# Altium schematic sheet Connectors.SchDoc: Connectors
size A4; Date: Not used; ApprovedBy: Not used; CheckedBy: Not used; Author: Not used; CompanyName: STMicroelectronics; DrawnBy: Not used; Engineer: Not used; Organization: Not used; Address1: Not used; Address2: Not used; Address3: Not used; Address4: Not used; DocumentNumber: 6; Revision: Not used; SheetNumber: 6; SheetTotal: 8; CurrentTime: Not used; CurrentDate: Not used; Time: Not used; DocumentFullPathAndName: Not used; DocumentName: Not used; ModifiedDate: Not used; ImagePath: Not used; ProjectName: Not used; Application_BuildNumber: Not used
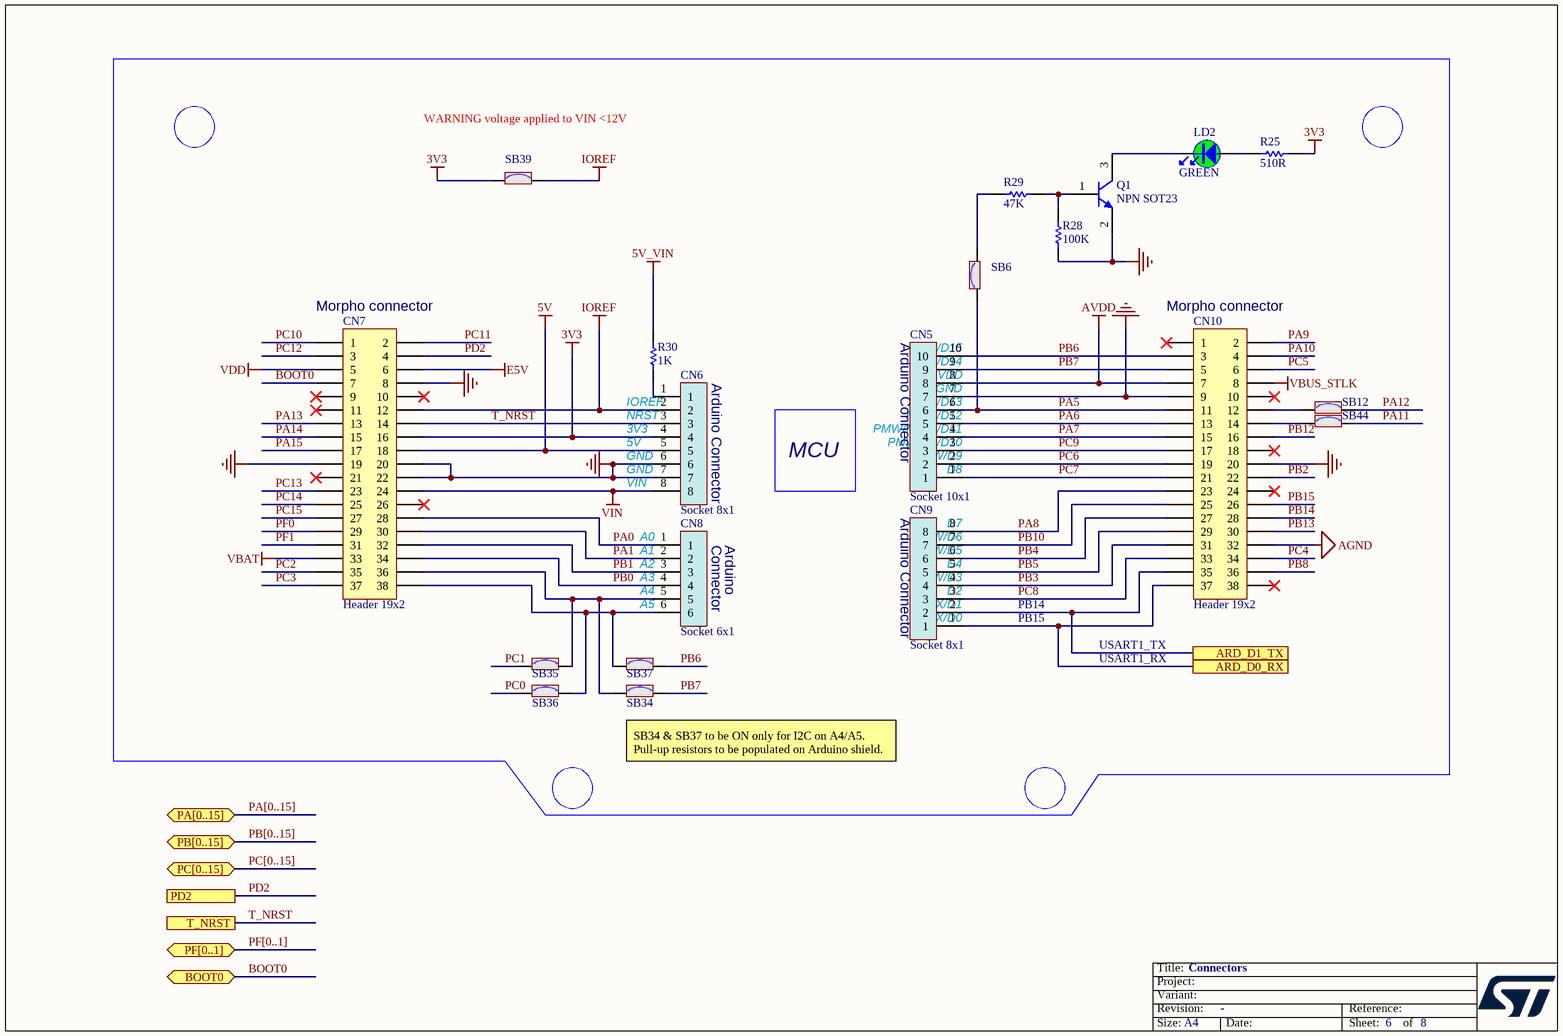
[diagram p0: Connectors.SchDoc]

## Parts
CN5  Socket 10x1  [CON_SAMTEC_SSQ-110-03-F-S]
CN6  Socket 8x1  [CON_SAMTEC_SSQ-108-03-F-S]
CN7  value Header 19x2  [CON_SAMTEC_TSW-119-09-X-D]
CN8  Socket 6x1  [CON_SAMTEC_SSQ-106-03-F-S]
CN9  Socket 8x1  [CON_SAMTEC_SSQ-108-03-F-S]
CN10  value Header 19x2  [CON_SAMTEC_TSW-119-09-X-D]
LD2  value GREEN  [LED_0603_OSRAM_LG-Q396-PS-35_GREEN_1A2K_H0P4]  (hidden comment: LED_green)
Q1  value NPN SOT23  [NPN_SOT23]
R25  value 510R  [R0603]
R28  value 100K  [R0603]
R29  value 47K  [R0603]
R30  value 1K  [R0603]
SB6  (no value)  [SOLDER-BRIDGE_R0603-0R]
SB12  (no value)  [SOLDER-BRIDGE_R0603-0R]
SB34  (no value)  [SOLDER-BRIDGE_R0603-0R]
SB35  (no value)  [SOLDER-BRIDGE_R0603-0R]
SB36  (no value)  [SOLDER-BRIDGE_R0603-0R]
SB37  (no value)  [SOLDER-BRIDGE_R0603-0R]
SB39  (no value)  [SOLDER-BRIDGE_R0603-0R]
SB44  (no value)  [SOLDER-BRIDGE_R0603-0R]

## Ports
ARD_D0_RX, ARD_D1_TX, BOOT0 (bidir), PA[0..15] (bidir), PB[0..15] (bidir), PC[0..15] (bidir), PD2, PF[0..1] (bidir), T_NRST

## Nets
3V3: CN6.4 CN7.16 R25.1 SB39.1
5V: CN6.5 CN7.18
5V_VIN: R30.2
AGND: CN10.32
AVDD: CN5.8 CN10.7
E5V: CN7.6
GND: CN5.7 CN6.6 CN6.7 CN7.8 CN7.19 CN7.20 CN7.22 CN10.9 CN10.20 Q1.2(E) R28.1
IOREF: CN6.2 CN7.12 SB39.2
VBAT: CN7.33
VBUS_STLK: CN10.8
VDD: CN7.5
VIN: CN6.8 CN7.24
ARD_D0_RX: CN9.1 CN10.37 ; port ARD_D0_RX
ARD_D1_TX: CN9.2 CN10.35 ; port ARD_D1_TX
BOOT0: CN7.7 ; port BOOT0
PA0: CN7.28 CN8.1
PA1: CN7.30 CN8.2
PA5: CN5.6 CN10.11 SB6.1
PA6: CN5.5 CN10.13
PA7: CN5.4 CN10.15
PA8: CN9.8 CN10.23
PA9: CN10.2
PA10: CN10.4
PA11: SB44.2
PA12: SB12.2
PA13: CN7.13
PA14: CN7.15
PA15: CN7.17
PB0: CN7.34 CN8.4
PB1: CN7.32 CN8.3
PB2: CN10.22
PB3: CN9.4 CN10.31
PB4: CN9.6 CN10.27
PB5: CN9.5 CN10.29
PB6: CN5.10 CN10.3 SB37.2
PB7: CN5.9 CN10.5 SB34.2
PB8: CN10.36
PB10: CN9.7 CN10.25
PB12: CN10.16
PB13: CN10.30
PB14: CN10.28
PB15: CN10.26
PC0: SB36.1
PC1: SB35.1
PC2: CN7.35
PC3: CN7.37
PC4: CN10.34
PC5: CN10.6
PC6: CN5.2 CN10.19
PC7: CN5.1 CN10.21
PC8: CN9.3 CN10.33
PC9: CN5.3 CN10.17
PC10: CN7.1
PC11: CN7.2
PC12: CN7.3
PC13: CN7.23
PC14: CN7.25
PC15: CN7.27
PD2: CN7.4 ; port PD2
PF0: CN7.29
PF1: CN7.31
T_NRST: CN6.3 CN7.14 ; port T_NRST
NetCN6_1: CN6.1 R30.1
NetCN7_36: CN7.36 CN8.5 SB34.1 SB35.2
NetCN7_38: CN7.38 CN8.6 SB36.2 SB37.1
NetCN10_12: CN10.12 SB12.1
NetCN10_14: CN10.14 SB44.1
NetLD2_1: LD2.1 R25.2
NetLD2_2: LD2.2 Q1.3(C)
NetQ1_1: Q1.1(B) R28.2 R29.2
NetR29_1: R29.1 SB6.2

Not connected (* = marked no-connect by the designer): CN7 9* 10* 11* 21* 26*; CN10 1* 10* 18* 24* 38*

## Buses and harness runs
bus PA[0..15] = port PA[0..15]
bus PB[0..15] = port PB[0..15]
bus PC[0..15] = port PC[0..15]
bus PF[0..1] = port PF[0..1]

## Notes on the sheet
- WARNING voltage applied to VIN <12V
- (near CN7) Morpho connector
- (near CN10) Morpho connector
- (near CN6) Arduino Connector
- (near CN5) Arduino Connector
- (near CN5) SDA/D14
- (near CN5) SCL/D15
- (near CN5) AVDD
- (near CN6) 5V
- 3V3
- NRST
- IOREF
- (near CN5) PMW/CS/D10
- (near CN5) SCK/D13
- (near CN5) MISO/D12
- (near CN5) PMW/MOSI/D11
- (near CN5) GND
- (near CN6) VIN
- (near CN6) GND
- MCU
- (near CN9) Arduino Connector
- (near CN5) D8
- (near CN5) PMW/D9
- (near CN8) A0
- (near CN8) A1
- (near CN8) A2
- (near CN8) A3
- (near CN8) Connector
- (near CN8) Arduino
- (near CN9) D4
- (near CN9) PMW/D3
- (near CN9) PMW/D5
- (near CN9) PMW/D6
- (near CN9) D7
- (near CN8) A4
- (near CN8) A5
- (near CN9) RX/D0
- (near CN9) TX/D1
- (near CN9) D2
- PB15
- PB14
- USART1_TX
- USART1_RX
- (near SB34) SB34 & SB37 to be ON only for I2C on A4/A5.
  Pull-up resistors to be populated on Arduino shield.
- Title:
- Project:
- Size:
- Revision:
- Variant:
- -
- Date:
- Reference:
- Sheet:
- of

## Library data of the parts
CN5 = MCD-02625: Socket, 10x1, 2.54mm, VR, TH, T=8.51mm/10mm; Part_Type: Connector; Part_Preference: Recommended; Manufacturer: SAMTEC; Manufacturer_Part_Number: SSQ-110-03-F-S; Order_Code_RS: 154-8308; Component_Country_Of_Origin: China, Costa Rica,  Malaysia, Vietnam, USA; ShowFields: YES; ID: 4731; Internal_Part_Number: MCD-02625; Value: Socket 10x1; Status: Checked; ComponentLink1URL: http://tunmcdsvn.tun.st.com/Component_Documentation_Library/Trunk/Connector/SAMTEC_SSQ_Series/; Order_Code_Digikey: SAM10010-ND; Order_Code_Farnell: 2667433
CN6 CN9 = MCD-02624: Socket, 8x1, 2.54mm, VR, TH, T=8.51mm/10mm; Part_Type: Connector; Part_Preference: Recommended; Manufacturer: SAMTEC; Manufacturer_Part_Number: SSQ-108-03-F-S; Order_Code_RS: 180-0395; Component_Country_Of_Origin: China, Costa Rica,  Malaysia, Vietnam, USA; ShowFields: YES; ID: 4730; Internal_Part_Number: MCD-02624; Value: Socket 8x1; Status: Checked; ComponentLink1URL: http://tunmcdsvn.tun.st.com/Component_Documentation_Library/Trunk/Connector/SAMTEC_SSQ_Series/; Order_Code_Digikey: SAM11912-ND; Order_Code_Farnell: 2505051
CN7 CN10 = MCD-00213: Header, 19x2, 2,54mm, VR, TH, Height 5.84mm/10.16mm; Manufacturer_Part_Number: TSW-119-09-x-D; Manufacturer: SAMTEC; Part_Type: Connector; Provided_By: SUBCO; Internal_Part_Number: MCD-00213; ECCN_US: n/a; ECCN_EU: n/a; ComponentLink1Description: Datasheet; Status: Released; ComponentLink1URL: http://tunmcdsvn.tun.st.com/Component_Datasheet_Library/Trunk/Connectors/Samtec_TSW-HTSW-series
CN8 = MCD-02623: Socket, 6x1, 2.54mm, VR, TH, T=8.51mm/10mm; Part_Type: Connector; Part_Preference: Recommended; Manufacturer: SAMTEC; Manufacturer_Part_Number: SSQ-106-03-F-S; Order_Code_RS: 180-0379; Component_Country_Of_Origin: China, Costa Rica,  Malaysia, Vietnam, USA; ShowFields: YES; ID: 4729; Internal_Part_Number: MCD-02623; Value: Socket 6x1; Status: Checked; ComponentLink1URL: http://tunmcdsvn.tun.st.com/Component_Documentation_Library/Trunk/Connector/SAMTEC_SSQ_Series/; Order_Code_Digikey: SAM10004-ND; Order_Code_Farnell: 2578705
LD2 = MCD-00588: LED Green, 0603 SMD, Forward Voltage Typ=2V, Max=2.5V; Part_Type: Display; Manufacturer_Part_Number: LG Q396-PS-35; Manufacturer: OSRAM OPTO SEMICONDUCTORS; Alternate_Manufacturer_Part_Number: VLMTG1300-GS08; Alternate_Manufacturer: VISHAY SEMICONDUCTOR OPTO DIVISION; Provided_By: SUBCO; Internal_Part_Number: MCD-00588; Status: Released; Package: LED 0603; ComponentLink1Description: Datasheet; ComponentLink1URL: http://tunmcdsvn.tun.st.com/Component_Datasheet_Library/Trunk/Display/OSRAM_LED_GREEN_LG Q396-PS-35; Order_Code_Digikey: LG Q396-PS-35-ND; ECCN_US: n/a; ECCN_EU: n/a
Q1 = MCD-00073: NPN Bipolar Transistor; Part_Type: IC; Manufacturer_Part_Number: BSR14; Manufacturer: ON SEMICONDUCTOR; Alternate_Manufacturer_Part_Number: MMBT2222LT1G / MMBT2222ALT1G / MMBT2222ALT3G; ECCN_US: EAR99; ECCN_EU: NEC; Provided_By: SUBCO; Revision: *; Internal_Part_Number: MCD-00073; Status: Released; ComponentLink1Description: Datasheet; ComponentLink1URL: http://tunmcdsvn.tun.st.com/Component_Datasheet_Library/Trunk/IC/NXP_Transistor_BSR14; Alternate_Manufacturer: ON SEMICONDUCTOR; Package: SOT23
R25 = MCD-00225: Resistor,510R,0603,1%,1/10W; Manufacturer_Part_Number: RC0603FR-07510RL; Manufacturer: YAGEO; ECCN_US: EAR99; ECCN_EU: NEC; Provided_By: SUBCO; Internal_Part_Number: MCD-00225; ComponentLink1Description: Datasheet; Status: Released; Part_Type: Resistor; Package: R0603; ComponentLink1URL: http://tunmcdsvn.tun.st.com/Component_Datasheet_Library/Trunk/Resistors/Yageo_Resistor_RC0603-series
R28 = MCD-00223: Resistor,100K,0603,1%,1/10W; Manufacturer_Part_Number: RC0603FR-07100KL; Manufacturer: YAGEO; Provided_By: Subcon; Initial_Board_Reference: MB1319; Internal_Part_Number: MCD-00223; Status: Released; Part_Type: Resistor; ComponentLink1Description: Yageo_Resistor_RC0603-series.pdf; ECCN_US: n/a; ECCN_EU: n/a; Package: R0603; ComponentLink1URL: http://tunmcdsvn.tun.st.com/Component_Datasheet_Library/Trunk/Resistors/Yageo_Resistor_RC0603-series
R29 = MCD-00222: Resistor,47K,0603,1%,1/10W; Manufacturer_Part_Number: RC0603FR-0747KL; Manufacturer: YAGEO; ECCN_US: EAR99; ECCN_EU: NEC; Provided_By: SUBCO; Internal_Part_Number: MCD-00222; Status: Released; Part_Type: Resistor; ComponentLink1Description: Datasheet; Package: R0603; ComponentLink1URL: http://tunmcdsvn.tun.st.com/Component_Datasheet_Library/Trunk/Resistors/Yageo_Resistor_RC0603-series
R30 = MCD-00070: Resistor,1K,0603,1%,1/10W; Manufacturer_Part_Number: RC0603FR-071KL; Manufacturer: YAGEO; Provided_By: Subcon; Initial_Board_Reference: MB1274; Internal_Part_Number: MCD-00070; ComponentLink1Description: Yageo_Resistor_RC0603-series.pdf; ECCN_US: n/a; ECCN_EU: n/a; Status: Released; Part_Type: Resistor; Package: R0603; ComponentLink1URL: http://tunmcdsvn.tun.st.com/Component_Datasheet_Library/Trunk/Resistors/Yageo_Resistor_RC0603-series
SB6 SB12 SB34-SB37 SB39 SB44 = MCD-00071: Solder Bridge ON; Part_Type: Mechanical; Manufacturer_Part_Number: RC0603JR-070RL; Manufacturer: YAGEO; Provided_By: SUBCO; Internal_Part_Number: MCD-00071; ECCN_US: n/a; ECCN_EU: n/a; Status: Released; Package: SB0603; ComponentLink1Description: Datasheet; ComponentLink1URL: http://tunmcdsvn.tun.st.com/Component_Datasheet_Library/Trunk/Resistors/Yageo_Resistor_RC0603-series